# EAGLE design Brain1port (EAGLE 9.3.2)
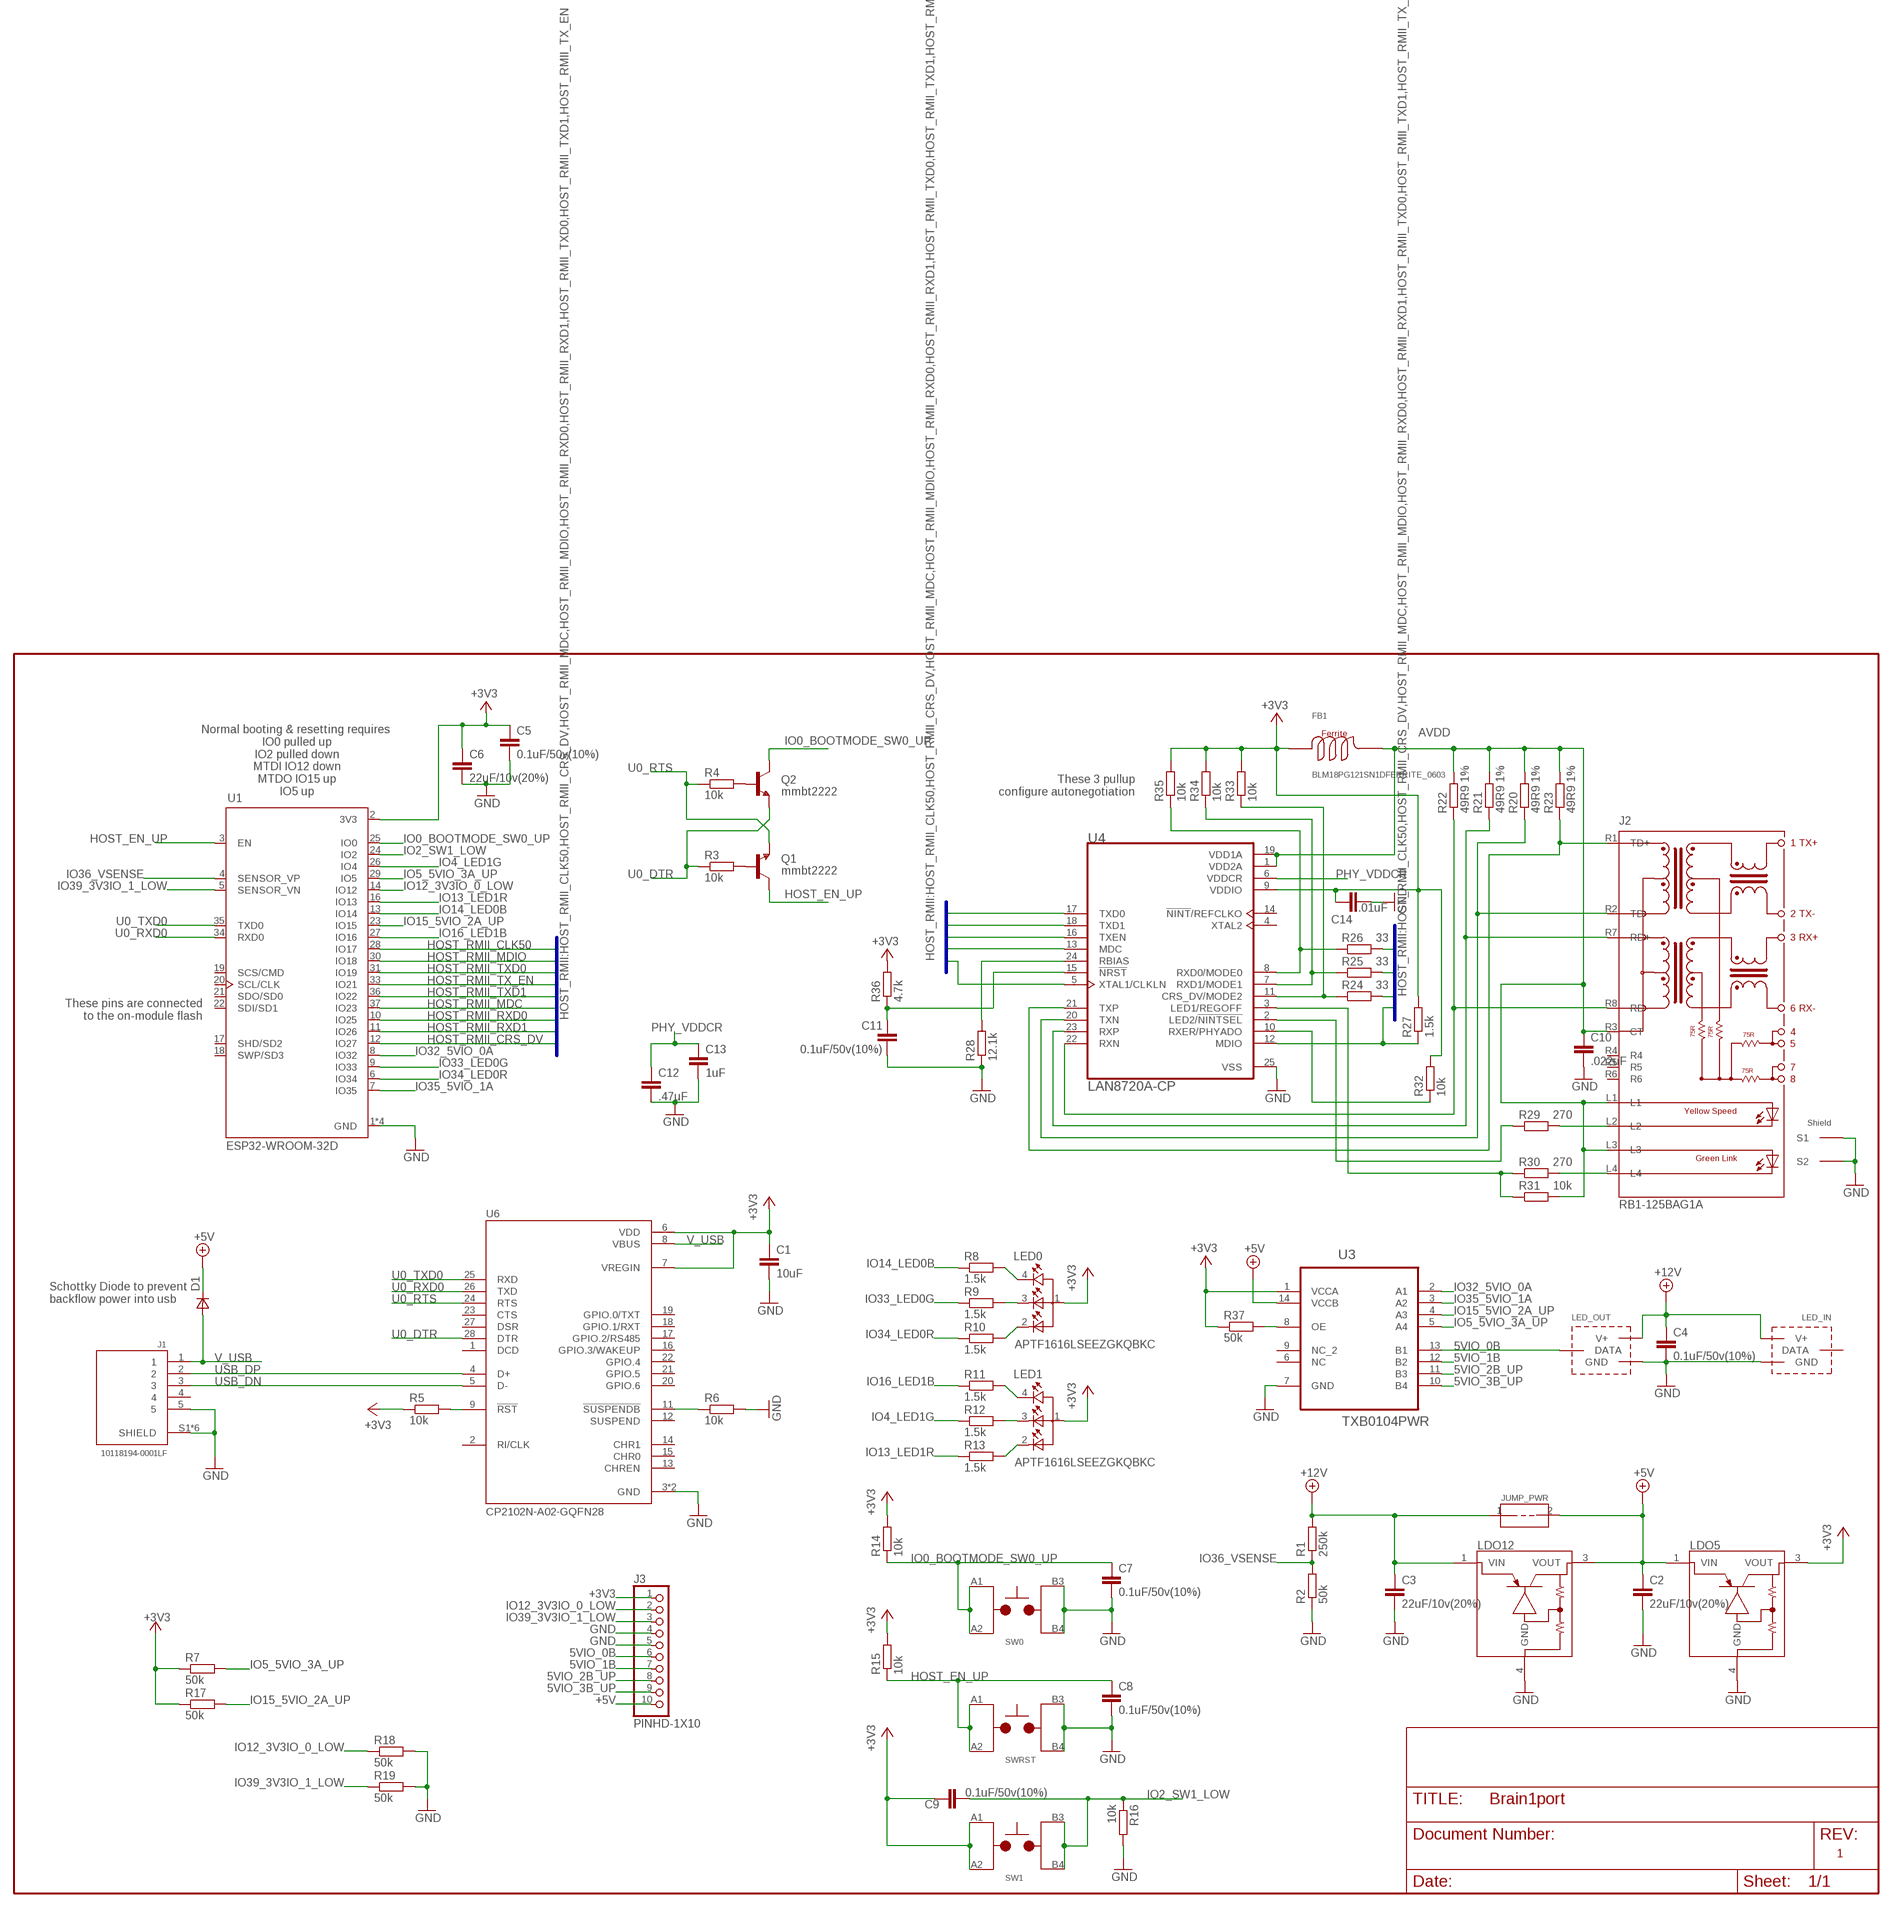
[diagram p0: schematic, sheet 1]

## Parts
C1  10uF  C-EUC0402  [C0402]
C2  22uF/10v(20%)  C-EUC0402  [C0402]
C3  22uF/10v(20%)  C-EUC0402  [C0402]
C4  0.1uF/50v(10%)  C-EUC0402  [C0402]
C5  0.1uF/50v(10%)  C-EUC0402  [C0402]
C6  22uF/10v(20%)  C-EUC0402  [C0402]
C7  0.1uF/50v(10%)  C-EUC0402  [C0402]
C8  0.1uF/50v(10%)  C-EUC0402  [C0402]
C9  0.1uF/50v(10%)  C-EUC0402  [C0402]
C10  .022uF  C-EUC0402  [C0402]
C11  0.1uF/50v(10%)  C-EUC0402  [C0402]
C12  .47uF  C-EUC0402  [C0402]
C13  1uF  C-EUC0402  [C0402]
C14  .01uF  C-EUC0402  [C0402]
D1  DSOD323  [SOD323]
FB1  BLM18PG121SN1DFERRITE_0603  [L0603]
J1  10118194-0001LF  [AMPHENOL_10118194-0001LF]
J2  RB1-125BAG1A  [WIZNET_RB1-125BAG1A]
J3  PINHD-1X10  [1X10-BIG]
JUMP_PWR  PWR_SUPPLY_SHORT050_DRILLED  [SHORT_050_DRILLED]
LDO5  NCP5501DPAK3  [TO229P990X238-3]
LDO12  NCP5501DPAK3  [TO229P990X238-3]
LED0  APTF1616LSEEZGKQBKC  [LEDSC160X160X070-4N]
LED1  APTF1616LSEEZGKQBKC  [LEDSC160X160X070-4N]
LED_IN  3WAY_LED_CONWIRES  [3WAY_LED_WIRES]
LED_OUT  3WAY_LED_CONWIRES  [3WAY_LED_WIRES]
Q1  mmbt2222  MMBT2222ALT1-NPN-SOT23-BEC  [SOT23-BEC]
Q2  mmbt2222  MMBT2222ALT1-NPN-SOT23-BEC  [SOT23-BEC]
R1  250k  R-EU_R0402  [R0402]
R2  50k  R-EU_R0402  [R0402]
R3  10k  R-EU_R0402  [R0402]
R4  10k  R-EU_R0402  [R0402]
R5  10k  R-EU_R0402  [R0402]
R6  10k  R-EU_R0402  [R0402]
R7  50k  R-EU_R0402  [R0402]
R8  1.5k  R-EU_R0402  [R0402]
R9  1.5k  R-EU_R0402  [R0402]
R10  1.5k  R-EU_R0402  [R0402]
R11  1.5k  R-EU_R0402  [R0402]
R12  1.5k  R-EU_R0402  [R0402]
R13  1.5k  R-EU_R0402  [R0402]
R14  10k  R-EU_R0402  [R0402]
R15  10k  R-EU_R0402  [R0402]
R16  10k  R-EU_R0402  [R0402]
R17  50k  R-EU_R0402  [R0402]
R18  50k  R-EU_R0402  [R0402]
R19  50k  R-EU_R0402  [R0402]
R20  49R9 1%  R-EU_R0402  [R0402]
R21  49R9 1%  R-EU_R0402  [R0402]
R22  49R9 1%  R-EU_R0402  [R0402]
R23  49R9 1%  R-EU_R0402  [R0402]
R24  33  R-EU_R0402  [R0402]
R25  33  R-EU_R0402  [R0402]
R26  33  R-EU_R0402  [R0402]
R27  1.5k  R-EU_R0402  [R0402]
R28  12.1k  R-EU_R0402  [R0402]
R29  270  R-EU_R0402  [R0402]
R30  270  R-EU_R0402  [R0402]
R31  10k  R-EU_R0402  [R0402]
R32  10k  R-EU_R0402  [R0402]
R33  10k  R-EU_R0402  [R0402]
R34  10k  R-EU_R0402  [R0402]
R35  10k  R-EU_R0402  [R0402]
R36  4.7k  R-EU_R0402  [R0402]
R37  50k  R-EU_R0402  [R0402]
SW0  TL3301T3301SWITCH  [SW-4]
SW1  TL3301T3301SWITCH  [SW-4]
SWRST  TL3301T3301SWITCH  [SW-4]
U1  ESP32-WROOM-32D  [MODULE_ESP32-WROOM-32D]
U3  TXB0104PWR  [SOP65P640X120-14N]
U4  LAN8720A-CP  [QFN50P400X400X100-25N]
U6  CP2102N-A02-GQFN28  CP2102N-A01-GQFN28  [QFN50P500X500X80-29N]
U$3  PWR_SUPPLY_SHORT050_DRILLED  [SHORT_050_DRILLED]  (not placed on a sheet)

## Nets
5VIO_0B: J3.6 LED_OUT.DATA U3.13(B1)
5VIO_1B: J3.7 U3.12(B2)
5VIO_2B_UP: J3.8 U3.11(B3)
5VIO_3B_UP: J3.9 U3.10(B4)
+3V3 [power]: C1.1 C5.1 C6.1 C9.1 C14.1 FB1.1 J3.1 LDO5.3(VOUT) LED0.1 LED1.1 R5.1 R7.1 R14.2 R15.2 R17.1 R27.2 R32.2 R33.2 R34.2 R35.2 R36.2 R37.1 SW1.A1 SW1.A2 U1.2(3V3) U3.1(VCCA) U4.9(VDDIO) U6.6(VDD) U6.7(VREGIN)
+5V [power]: C2.1 D1.1(C) J3.10 JUMP_PWR.2 LDO5.1(VIN) LDO12.3(VOUT) U3.14(VCCB)
+12V: C3.1 C4.1 JUMP_PWR.1 LDO12.1(VIN) LED_IN.V+ LED_OUT.V+ R1.2
AVDD: C10.1 FB1.2 J2.L1 J2.L3 J2.R3(CT) R20.2 R21.2 R22.2 R23.2 R31.2 U4.1(VDD2A) U4.19(VDD1A)
GND [power]: C1.2 C2.2 C3.2 C4.2 C5.2 C6.2 C7.2 C8.2 C10.2 C11.2 C12.2 C13.2 C14.2 J1.5 J1.S1(SHIELD) J1.S2(SHIELD) J1.S3(SHIELD) J1.S4(SHIELD) J1.S5(SHIELD) J1.S6(SHIELD) J2.S1 J2.S2 J3.4 J3.5 LDO5.4(GND) LDO12.4(GND) LED_IN.GND LED_OUT.GND R2.1 R6.2 R16.2 R18.2 R19.2 R28.1 SW0.B3 SW0.B4 SWRST.B3 SWRST.B4 U1.1(GND) U1.15(GND) U1.38(GND) U1.39(GND) U3.7(GND) U4.25(VSS) U6.3(GND) U6.29(GND)
HOST_EN_UP: C8.1 Q1.C R15.1 SWRST.A1 SWRST.A2 U1.3(EN)
HOST_RMII_CLK50: U1.28(IO17) U4.5(XTAL1/CLKLN)
HOST_RMII_CRS_DV: R24.2 U1.12(IO27)
HOST_RMII_MDC: U1.37(IO23) U4.13(MDC)
HOST_RMII_MDIO: R27.1 U1.30(IO18) U4.12(MDIO)
HOST_RMII_RXD0: R26.2 U1.10(IO25)
HOST_RMII_RXD1: R25.2 U1.11(IO26)
HOST_RMII_TX_EN: U1.33(IO21) U4.16(TXEN)
HOST_RMII_TXD0: U1.31(IO19) U4.17(TXD0)
HOST_RMII_TXD1: U1.36(IO22) U4.18(TXD1)
IO0_BOOTMODE_SW0_UP: C7.1 Q2.C R14.1 SW0.A1 SW0.A2 U1.25(IO0)
IO2_SW1_LOW: C9.2 R16.1 SW1.B3 SW1.B4 U1.24(IO2)
IO4_LED1G: R12.1 U1.26(IO4)
IO5_5VIO_3A_UP: R7.2 U1.29(IO5) U3.5(A4)
IO12_3V3IO_0_LOW: J3.2 R18.1 U1.14(IO12)
IO13_LED1R: R13.1 U1.16(IO13)
IO14_LED0B: R8.1 U1.13(IO14)
IO15_5VIO_2A_UP: R17.2 U1.23(IO15) U3.4(A3)
IO16_LED1B: R11.1 U1.27(IO16)
IO32_5VIO_0A: U1.8(IO32) U3.2(A1)
IO33_LED0G: R9.1 U1.9(IO33)
IO34_LED0R: R10.1 U1.6(IO34)
IO35_5VIO_1A: U1.7(IO35) U3.3(A2)
IO36_VSENSE: R1.1 R2.2 U1.4(SENSOR_VP)
IO39_3V3IO_1_LOW: J3.3 R19.1 U1.5(SENSOR_VN)
N$5: R5.2 U6.9(!RST)
N$6: R6.1 U6.11(!SUSPENDB)
N$7: Q1.B R3.2
N$8: Q2.B R4.2
N$9: LED0.4 R8.2
N$10: LED0.3 R9.2
N$11: LED0.2 R10.2
N$12: J2.R8(RD-) R22.1 U4.22(RXN)
N$13: J2.R7(RD+) R21.1 U4.23(RXP)
N$14: LED1.4 R11.2
N$15: LED1.3 R12.2
N$16: LED1.2 R13.2
N$17: J2.R2(TD-) R20.1 U4.20(TXN)
N$18: R24.1 R33.1 U4.11(CRS_DV/MODE2)
N$19: J2.R1(TD+) R23.1 U4.21(TXP)
N$20: R25.1 R34.1 U4.7(RXD1/MODE1)
N$21: R26.1 R35.1 U4.8(RXD0/MODE0)
N$22: R28.2 U4.24(RBIAS)
N$23: R30.1 R31.1 U4.3(LED1/REGOFF)
N$24: R29.1 U4.2(LED2/!NINTSEL!)
N$25: J2.L2 R29.2
N$26: J2.L4 R30.2
N$27: R37.2 U3.8(OE)
N$28: C11.1 R36.1 U4.15(!NRST)
N$29: R32.1 U4.10(RXER/PHYADO)
PHY_VDDCR: C12.1 C13.1 U4.6(VDDCR)
U0_DTR: Q2.E R3.1 U6.28(DTR)
U0_RTS: Q1.E R4.1 U6.24(RTS)
U0_RXD0: U1.34(RXD0) U6.26(TXD)
U0_TXD0: U1.35(TXD0) U6.25(RXD)
USB_DN: J1.3 U6.5(D-)
USB_DP: J1.2 U6.4(D+)
V_USB [power]: D1.2(A) J1.1 U6.8(VBUS)
Unconnected: J1.4 J2.R4 J2.R5 J2.R6 LED_IN.DATA U1.17(SHD/SD2) U1.18(SWP/SD3) U1.19(SCS/CMD) U1.20(SCL/CLK) U1.21(SDO/SD0) U1.22(SDI/SD1) U3.6(NC) U3.9(NC_2) U4.4(XTAL2) U4.14(!NINT!/REFCLKO) U6.1(DCD) U6.2(RI/CLK) U6.12(SUSPEND) U6.13(CHREN) U6.14(CHR1) U6.15(CHR0) U6.16(GPIO.3/WAKEUP) U6.17(GPIO.2/RS485) U6.18(GPIO.1/RXT) U6.19(GPIO.0/TXT) U6.20(GPIO.6) U6.21(GPIO.5) U6.22(GPIO.4) U6.23(CTS) U6.27(DSR) U$3.1 U$3.2

## Buses
HOST_RMII:HOST_RMII_CLK50,HOST_RMII_CRS_DV,HOST_RMII_MDC,HOST_RMII_MDIO,HOST_RMII_RXD0,HOST_RMII_RXD1,HOST_RMII_TXD0,HOST_RMII_TXD1,HOST_RMII_TX_EN

## Notes on the sheet
- Normal booting & resetting requires 
  IO0 pulled up
  IO2 pulled down
  MTDI IO12 down
  MTDO IO15 up
  IO5 up
- These 3 pullup
  configure autonegotiation
- These pins are connected
  to the on-module flash
- Schottky Diode to prevent
  backflow power into usb
- 1

## Library data of the parts
C1-C14 = rcl:C-EU: CAPACITOR, European symbol
D1 = zetex:D: DIODE; MPN: CDSOD323-T05C; OC_FARNELL: 1824860; OC_NEWARK: 79R6078
FB1 = TomSeago:BLM18PG121SN1D
J1 = 10118194-0001LF:10118194-0001LF: Micro Usb, 2.0 Type b, Rcpt, Smt; DESCRIPTION: Micro Usb, 2.0 Type b, Rcpt, Smt; DIGI-KEY_PART_NUMBER: 609-4618-1-ND; DIGI-KEY_PURCHASE_URL: https://www.digikey.com/product-detail/en/amphenol-icc-fci/10118194-0001LF/609-4618-1-ND/2785382?utm_source=snapeda&utm_medium=aggregator&utm_campaign=symbol; MF: Amphenol ICC; MP: 10118194-0001LF; PACKAGE: None
J2 = TomSeago:RB1-125BAG1A: Wiznet RB1-125BAG1A RJ45 1x1 Tab Down Through Hole
J3 = adafruit:PINHD-1X10: Pin header 1x10 0.1" spacing With round pins
JUMP_PWR U$3 = TomSeago:PWR_SUPPLY_SHORT
LDO5 LDO12 = TomSeago:NCP5501
LED0 LED1 = APTF1616LSEEZGKQBKC:APTF1616LSEEZGKQBKC: HELI Colour; 1.6X1.6MM LOW CURRENT RGB SMD LED; AVAILABILITY: Unavailable; DESCRIPTION: HELI Colour; 1.6X1.6MM LOW CURRENT RGB SMD LED; MF: Kingbright; MP: APTF1616LSEEZGKQBKC; PACKAGE: 0606 Kingbright; PRICE: None
LED_IN LED_OUT = TomSeago:3WAY_LED_CON
Q1 Q2 = transistor:*-NPN-: NPN Transistror BF959 corrected 2008.03.06
R1-R37 = rcl:R-EU_: RESISTOR, European symbol
SW0 SW1 SWRST = TomSeago:TL3301
U1 = ESP32-WROOM-32D:ESP32-WROOM-32D: IC: SoC; GPIO, I2C, I2S, IR, SD, SDIO, SPI, UART; 2.7÷3.6VDC; 20dBm; DESCRIPTION: IC: SoC; GPIO, I2C, I2S, IR, SD, SDIO, SPI, UART; 2.7÷3.6VDC; 20dBm; DIGI-KEY_PART_NUMBER: 1904-1023-1-ND; DIGI-KEY_PURCHASE_URL: https://www.digikey.com/product-detail/en/espressif-systems/ESP32-WROOM-32D/1904-1023-1-ND/9381732?utm_source=snapeda&utm_medium=aggregator&utm_campaign=symbol; MF: Espressif Systems; MP: ESP32-WROOM-32D; PACKAGE: Module Espressif Systems
U3 = TXB0104PWR:TXB0104PWR: 4-BIT BIDIRECTIONAL VOLTAGE-LEVEL TRANSLATOR; AVAILABILITY: Unavailable; DESCRIPTION: 4-Bit Bidirectional Voltage-Level Shifter with Auto Direction Sensing and +/-15 kV ESD Protect 14-TSSOP -40 to 85; MF: Texas Instruments; MP: TXB0104PWR; PACKAGE: TSSOP-14 Texas Instruments; PRICE: None
U4 = LAN8720A-CP:LAN8720A-CP: LAN8720A Series 3.3 V RMII 10/100 Ethernet Transceiver Surface Mount - QFN-24; DESCRIPTION: LAN8720A Series 3.3 V RMII 10/100 Ethernet Transceiver Surface Mount - QFN-24; DIGI-KEY_PART_NUMBER: 638-1080-ND; DIGI-KEY_PURCHASE_URL: https://www.digikey.com/product-detail/en/microchip-technology/LAN8720A-CP/638-1080-ND/2051556?utm_source=snapeda&utm_medium=aggregator&utm_campaign=symbol; MF: Microchip; MP: LAN8720A-CP; PACKAGE: QFN-24 Microchip
U6 = CP2102N-A01-GQFN28:CP2102N-A01-GQFN28: Ic Bridge Usb To Uart 28qfn; AVAILABILITY: Unavailable; DESCRIPTION: Usb-Uart Interface Bridge, Qfn-28; MF: Silicon Labs; MP: CP2102N-A01-GQFN28; PACKAGE: QFN-28 Silicon Labs; PRICE: None

## Net classes
1 power: width 0.61 mm, clearance 0.203 mm

## Board
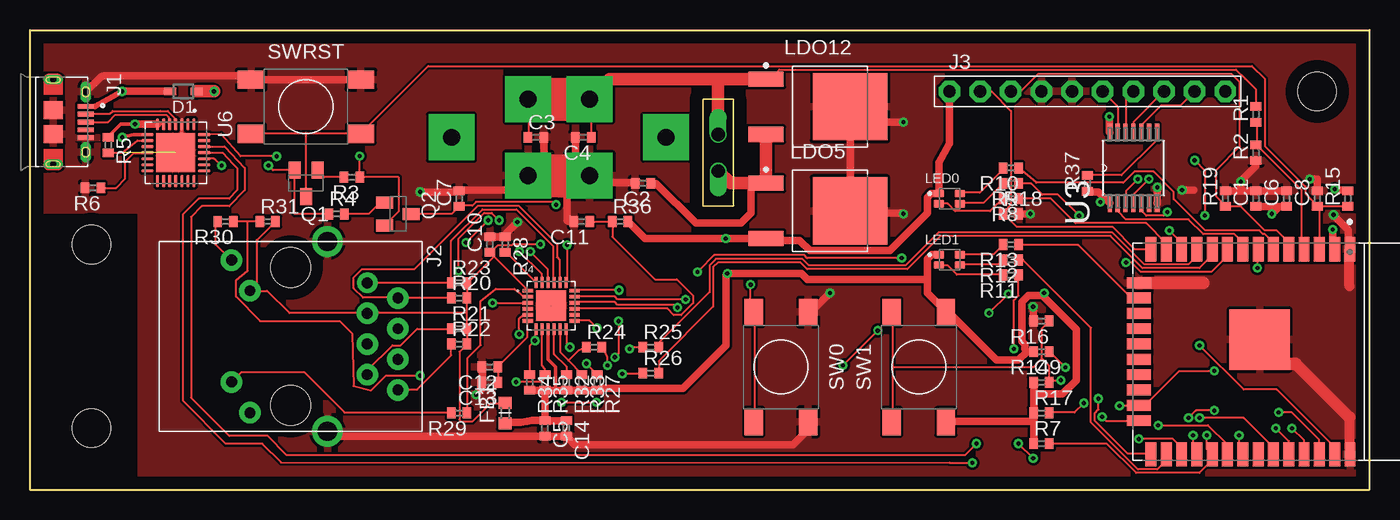
[diagram p1: board, top side]
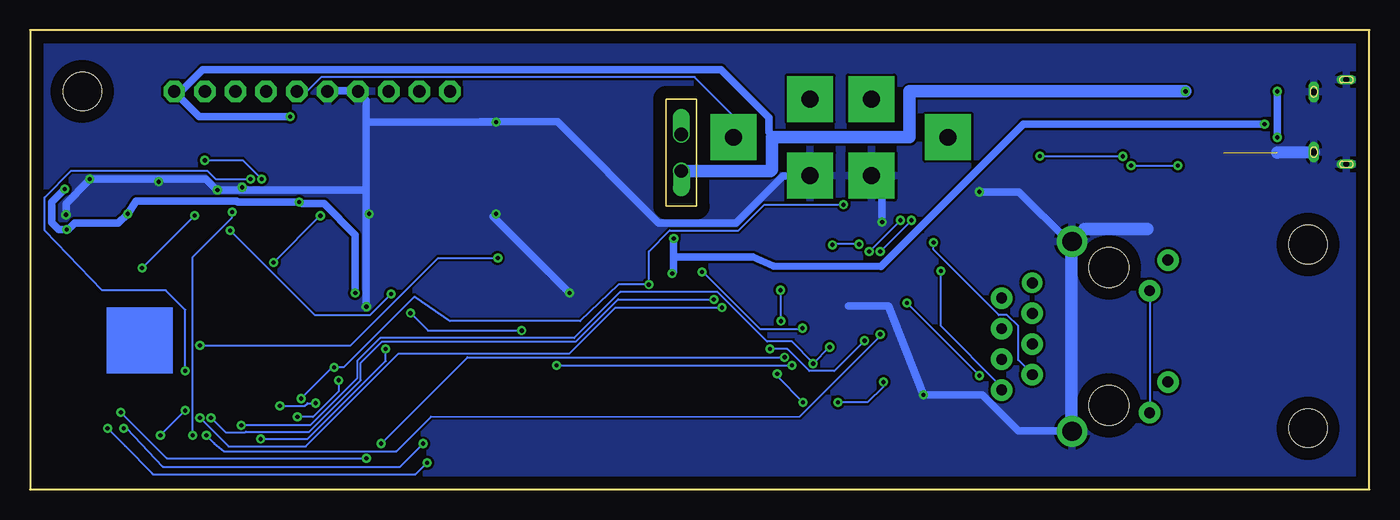
[diagram p2: board, bottom side, seen from below]

Size 111 x 38.1 mm. Coordinates in mm from the lower left corner, seen from the top.
Outline: 0,0 0,38.1 111,38.1 111,0 0,0
Copper layers (1*16): Top 0.035mm / dielectric 1.5mm / Bottom 0.035mm
Design rules "default *": minimum track width 6mil, minimum drill 0.35mm, track to track 6mil, track to pad 6mil, pad to pad 6mil, via to via 6mil, smd to smd 6mil, copper to edge 40mil, drill to drill 18mil, minimum pad ring 6mil, minimum via ring 8mil, stop-mask expansion 4mil, vias tented up to drill 0mil, thermal gap 10mil
Holes 3.17 mm at 5.08,5.08 5.08,20.32 106.68,33.02
tRestrict: area 0,0 to 8.9,22.9

### Footprints (pad centres in the part's own frame; a part is rotated, then mirrored left to right if it is on the bottom)
C0402 = smd 0.7 x 0.9: 1 -0.65,0; 2 0.65,0
SOD323 = smd 1 x 0.6: 1 -1.1,0; 2 1.1,0
L0603 = smd 1 x 1.1: 1 -0.85,0; 2 0.85,0
AMPHENOL_10118194-0001LF = smd 0.4 x 1.35: 1 -1.3,2.7; 2 -0.65,2.7; 3 0,2.7; 4 0.65,2.7; 5 1.3,2.7 | drill 0.55 pad 0.65 long: S1 -2.5,2.7; S2 2.5,2.7 | drill 0.5 pad 0.775 long: S3 -3.5,0; S6 3.5,0 | smd 1.5 x 1.55: S4 -1,0; S5 1,0
WIZNET_RB1-125BAG1A = drill 0.9 pad 1.778: L1 6.325,-3.38; L2 3.784,-4.899; L3 -3.786,-3.379; L4 -6.325,-4.9; R2 -3.176,8.889; R3 -1.906,6.349; R4 -0.636,8.889; R5 0.634,6.349; R6 1.904,8.889; R7 3.174,6.349; R8 4.444,8.889 | drill 0.9 pad 1.7: R1 -4.446,6.349 | drill 1.6 pad 2.54: S1 -7.876,3.049; S2 7.874,3.049 | hole 3.3: 5.714,-0.001; -5.716,-0.001
1X10-BIG = drill 1.016 pad 1.778 octagon: 1 -11.43,0; 2 -8.89,0; 3 -6.35,0; 4 -3.81,0; 5 -1.27,0; 6 1.27,0; 7 3.81,0; 8 6.35,0; 9 8.89,0; 10 11.43,0
SHORT_050_DRILLED = drill 1.1 offset: 1 -0.889,0; 2 2.159,0
TO229P990X238-3 = smd 2.934 x 1.256: 1 -4.291,2.29; 3 -4.291,-2.29 | smd 6.154 x 5.567: 4 2.681,0
LEDSC160X160X070-4N = smd 0.89 x 0.64: 1 -0.87,0.425; 2 0.87,0.425; 3 0.87,-0.425; 4 -0.87,-0.425
3WAY_LED_WIRES = drill 1.4 pad 3.81 square: DATA -3.175,0; GND 3.175,-3.175; V+ 3.175,3.175
SOT23-BEC = smd 1 x 1.4: B -0.95,-1.1; C 0,1.1; E 0.95,-1.1
R0402 = smd 0.7 x 0.9: 1 -0.65,0; 2 0.65,0
SW-4 = smd 2.212 x 1.512: A1 -4.55,-2.25; A2 4.55,-2.25; B3 -4.55,2.25; B4 4.55,2.25
MODULE_ESP32-WROOM-32D = smd 2 x 0.9: 1 -8.5,5.26; 2 -8.5,3.99; 3 -8.5,2.72; 4 -8.5,1.45; 5 -8.5,0.18; 6 -8.5,-1.09; 7 -8.5,-2.36; 8 -8.5,-3.63; 9 -8.5,-4.9; 10 -8.5,-6.17; 11 -8.5,-7.44; 12 -8.5,-8.71; 13 -8.5,-9.98; 14 -8.5,-11.25; 25 8.5,-11.25; 26 8.5,-9.98; 27 8.5,-8.71; 28 8.5,-7.44; 29 8.5,-6.17; 30 8.5,-4.9; 31 8.5,-3.63; 32 8.5,-2.36; 33 8.5,-1.09; 34 8.5,0.18; 35 8.5,1.45; 36 8.5,2.72; 37 8.5,3.99; 38 8.5,5.26 | smd 0.9 x 2: 15 -5.715,-12.25; 16 -4.445,-12.25; 17 -3.175,-12.25; 18 -1.905,-12.25; 19 -0.635,-12.25; 20 0.635,-12.25; 21 1.905,-12.25; 22 3.175,-12.25; 23 4.445,-12.25; 24 5.715,-12.25 | smd 5 x 5: 39 -1,-2.24
SOP65P640X120-14N = smd 1.473 x 0.356: 1 -2.921,1.956; 2 -2.921,1.295; 3 -2.921,0.66; 4 -2.921,0; 5 -2.921,-0.66; 6 -2.921,-1.295; 7 -2.921,-1.956; 8 2.921,-1.956; 9 2.921,-1.295; 10 2.921,-0.66; 11 2.921,0; 12 2.921,0.66; 13 2.921,1.295; 14 2.921,1.956
QFN50P400X400X100-25N = smd 0.86 x 0.26: 1 -1.935,1.25; 2 -1.935,0.75; 3 -1.935,0.25; 4 -1.935,-0.25; 5 -1.935,-0.75; 6 -1.935,-1.25; 13 1.935,-1.25; 14 1.935,-0.75; 15 1.935,-0.25; 16 1.935,0.25; 17 1.935,0.75; 18 1.935,1.25 | smd 0.26 x 0.86: 7 -1.25,-1.935; 8 -0.75,-1.935; 9 -0.25,-1.935; 10 0.25,-1.935; 11 0.75,-1.935; 12 1.25,-1.935; 19 1.25,1.935; 20 0.75,1.935; 21 0.25,1.935; 22 -0.25,1.935; 23 -0.75,1.935; 24 -1.25,1.935 | smd 2.5 x 2.5: 25 0,0
QFN50P500X500X80-29N = smd 1.01 x 0.27: 1 -2.36,1.5; 2 -2.36,1; 3 -2.36,0.5; 4 -2.36,0; 5 -2.36,-0.5; 6 -2.36,-1; 7 -2.36,-1.5; 15 2.36,-1.5; 16 2.36,-1; 17 2.36,-0.5; 18 2.36,0; 19 2.36,0.5; 20 2.36,1; 21 2.36,1.5 | smd 0.27 x 1.01: 8 -1.5,-2.36; 9 -1,-2.36; 10 -0.5,-2.36; 11 0,-2.36; 12 0.5,-2.36; 13 1,-2.36; 14 1.5,-2.36; 22 1.5,2.36; 23 1,2.36; 24 0.5,2.36; 25 0,2.36; 26 -0.5,2.36; 27 -1,2.36; 28 -1.5,2.36 | smd 3.25 x 3.25: 29 0,0

### Placement (x,y rotation side)
C1  101.6,24.13 90 top
C2  50.8,25.4 180 top
C3  41.91,29.21 0 top
C4  45.85,29.21 180 top
C5  42.67,5.08 270 top
C6  104.14,24.13 90 top
C7  35.56,24.13 90 top
C8  106.68,24.13 90 top
C9  83.82,8.89 0 top
C10  38.1,20.32 90 top
C11  45.72,22.23 180 top
C12  38.1,10.16 180 top
C13  38.1,8.89 180 top
C14  44.45,5.08 270 top
D1  12.7,33.02 180 top
FB1  39.37,6.35 90 top
J1  1.91,30.48 270 top
J2  21.59,12.7 270 top
J3  87.63,33.02 0 top
JUMP_PWR  57.02,28.57 270 top
LDO5  65.28,23.11 0 top
LDO12  65.28,31.75 0 top
LED0  76.2,24.13 0 top
LED1  76.2,19.05 0 top
LED_IN  38.1,29.21 0 top
LED_OUT  49.53,29.21 0 bottom
Q1  22.86,25.4 180 top
Q2  30.48,22.86 270 top
R1  101.6,31.11 90 top
R2  101.6,27.94 90 top
R3  26.67,25.91 180 top
R4  25.4,22.86 0 top
R5  6.48,28.57 270 top
R6  5.21,25.02 180 top
R7  83.82,3.81 0 top
R8  81.28,24.13 180 top
R9  81.28,25.4 180 top
R10  81.28,26.67 180 top
R11  81.28,17.78 180 top
R12  81.28,19.05 180 top
R13  81.28,20.32 180 top
R14  83.82,11.43 180 top
R15  109.22,24.13 90 top
R16  83.82,13.97 180 top
R17  83.82,6.35 0 top
R18  81.28,22.86 0 top
R19  99.06,24.13 90 top
R20  35.56,15.88 0 top
R21  35.56,13.34 0 top
R22  35.56,12.06 0 top
R23  35.56,17.14 0 top
R24  46.74,11.81 0 top
R25  51.44,11.81 0 top
R26  51.44,9.65 0 top
R27  46.99,8.89 270 top
R28  39.37,20.32 270 top
R29  35.56,6.35 180 top
R30  16.19,22.23 180 top
R31  19.68,22.23 0 top
R32  44.45,8.89 270 top
R33  45.72,8.89 270 top
R34  41.4,8.89 270 top
R35  42.67,8.89 270 top
R36  48.9,22.23 0 top
R37  87.63,25.4 90 top
SW0  62.23,10.16 270 top
SW1  73.66,10.16 90 top
SWRST  22.86,31.75 0 top
U1  104.14,11.43 270 top
U3  91.44,26.67 90 top
U4  43.18,15.24 0 top
U6  12.06,27.94 270 top

### Tracks (layer width: path | path; a pad name or v marks a point on that pad's centre or on a via)
5VIO_0B
  Top 0.152: U3.13 90.14,31.77 J3.6
  Bottom 0.152: J3.6 88.85,33.07 88.01,33.07 86.87,34.21 55.93,34.21 52.73,31.01 52.73,29.26 LED_OUT.DATA
5VIO_1B
  Top 0.152: U3.12 90.83,29.64 90.83,32.38 91.44,32.99 J3.7
5VIO_2B_UP
  Top 0.152: U3.11 91.44,30.48 J3.8
5VIO_3B_UP
  Top 0.152: U3.10 92.13,29.64 92.13,30.25 93.73,31.85 95.33,31.85 96.47,32.99 J3.9
+3V3  (via drill 0.35)
  Top 0.152: 7.5,30.29 7.5,30.31 | v8.69,30.3 8.67,30.29
  Top 0.254: U6.6 U6.7
  Top 0.305: 7.5,30.31 6.48,29.29 R5.1 | 8.67,30.29 7.5,30.29 | U4.9 42.93,10.79 43.56,10.16 43.56,8.23
  Top 0.61: U3.1 89.04,24.19 | 89.04,24.19 88.54,24.69 87.63,24.69 R37.1 | C1.1 101.65,23.47 104.09,23.47 C6.1 103.54,23.48 v102.92,22.86 | v108.13,24.92 108.2,24.84 109.19,24.84 R15.2 | v107.97,21.57 107.97,20.09 U1.2 | v88.7,23.85 89.04,24.19 | 83.21,5.64 83.21,6.33 R17.1 83.21,6.63 83.21,7.92 | 83.21,5.64 83.21,3.81 R7.1 | 83.21,7.92 83.21,8.84 C9.1 | 83.21,5.64 75.97,5.64 SW1.A1 | R34.2 42.62,8.23 R35.2 | R35.2 42.93,8.23 43.56,8.23 44.42,8.23 R32.2 44.73,8.23 R33.2 45.95,8.23 46.94,8.23 R27.2 47.24,8.38 54.13,8.38 57.68,11.94 57.68,17.8 v57.78,17.91 63.93,17.91 64.41,17.42 74.37,17.42 | C5.1 42.7,5.71 44.42,5.71 C14.1 | FB1.1 39.4,5.56 40.64,5.56 41.2,5.66 41.61,5.73 C5.1 | R35.2 C5.1 | 74.37,17.42 74.37,16.31 75.89,14.78 SW1.A2 76.2,14.63 80.09,10.74 81.92,10.74 82.6,11.43 | 74.37,17.42 74.37,19.13 74.75,19.51 75.29,19.51 LED1.1 | 82.6,11.43 R14.2 | 83.21,7.92 85.57,7.92 86.72,9.07 86.72,13.26 83.9,16.08 | 83.9,16.08 82.75,16.08 82.22,15.54 82.22,12.27 82.45,12.04 82.45,11.66 82.6,11.43 | v84.05,16.31 83.9,16.08 | R36.2 50.94,20.83 v57.66,20.83 57.91,20.83 LDO5.3 | J3.1 76.2,28.67 75.33,27.09 LED0.1 75.06,24.54 74.68,24.54 74.37,24.23 74.37,22.94 71.25,19.81 64.62,19.81 63.78,20.65 61.49,20.65 LDO5.3 | U6.7 v8.69,30.3 | LDO5.3
  Bottom 0.61: v108.13,24.92 109.19,23.85 109.19,22.15 108.61,21.57 v107.97,21.57 107.82,21.57 107.29,22.1 103.68,22.1 v102.92,22.86 102.21,23.93 93.88,23.93 93.8,23.85 v88.7,23.85 88.47,23.7 86.64,23.7 84.05,21.11 v84.05,16.31 | v8.69,30.3 28.68,30.3 40.46,18.52 49.4,18.54 51.08,19.3 57.66,19.3 v57.66,20.83 57.66,18.03 v57.78,17.91
+5V  (via drill 0.35)
  Top 0.61: C2.1 51.51,25.38 51.89,25.38 55.17,22.1 58.9,22.1 59.74,22.94 59.74,24.92 LDO5.1 | v89.46,30.94 89.46,29.64 U3.14
  Top 1.016: LDO12.3 LDO5.1 58.03,25.4 JUMP_PWR.2 | v15.24,33.02 D1.1
  Bottom 0.61: v89.46,30.94 97,30.94 99.06,32.99 J3.10 98.6,32.92 96.7,34.82 53.72,34.82 49.76,30.86 49.76,29.64 49.53,29.21
  Bottom 1.016: JUMP_PWR.2 49.66,26.42 49.53,26.54 49.53,29.21 38.1,29.21 38.1,33.02 v15.24,33.02
+12V
  Top 0.152: C3.1 41.3,29.26 41.3,30.63 LED_IN.V+ | LED_OUT.V+ 46.35,31.23 46.57,31.17 46.5,31.1 C4.1 | LDO12.1 61.49,34.21 62.1,34.82 99.95,34.82 100.71,34.06 100.74,34.06 101.58,33.22 101.58,31.77 R1.2
  Top 1.016: LDO12.1 56.9,34.04 | 56.9,34.04 48.01,34.04 LED_OUT.V+ | JUMP_PWR.1 57.02,33.91 56.9,34.04
  Top 3.556: LED_IN.V+ LED_OUT.V+
AVDD  (via drill 0.35)
  Top 0.152: 38.44,19.32 C10.1 38.18,19.66 38.79,20.27 39.93,20.27 40.01,20.34 v42.29,20.34 | 38.44,19.32 41.22,16.54 U4.1 | v44.5,20.3 44.5,17.22 U4.19 | 36.2,13.34 36.2,12.12 R22.2 36.2,12.04 35.59,11.43 35.59,5.79 35.74,5.64 36.65,5.64 38.18,7.16 39.32,7.16 FB1.2 | 36.2,13.34 36.2,14.63 | 36.2,14.63 36.2,15.85 R20.2 36.2,15.93 36.2,17.14 R23.2 36.27,17.14 38.44,19.32 | 36.2,13.34 R21.2 | 36.2,14.63 27.96,14.63 J2.R3 27.89,14.63 21.49,14.63 19.63,16.49 J2.L3 18.8,17.07 18.8,20.7 R31.2
  Bottom 0.152: J2.L1 18.21,6.4 18.21,16.46 J2.L3 | v44.5,20.3 44.45,20.34 v42.29,20.34
GND  (via drill 0.35)  (2 unrouted)
  Top 0.305: U6.3 12.57,29.34 12.57,29.21
  Top 0.61: 101.88,12.5 U1.39 102.11,12.19 | 109.35,2.97 U1.38 | 109.35,19.89 U1.1 109.27,20.19 109.27,21.54 v108.03,22.78 | 100.36,24.77 101.58,24.77 C1.2 101.88,24.77 104.09,24.77 C6.2 | 100.36,24.77 99.06,24.77 R19.2 | C8.2 106.68,25.76 v106.07,25.76 | v83.13,15.16 83.13,14.02 R16.2 | v95.48,24.84 96.47,24.84 | v93.42,25.07 93.42,23.77 U3.7 | 100.36,24.77 v100.36,25.53 100.51,25.76 101.58,26.82 101.58,27.28 R2.1 | v72.39,30.48 71.12,30.48 LDO12.4 67.97,31.7 67.97,23.16 LDO5.4 68.2,22.94 72.31,22.94 v72.39,22.86 | J1.S5 2.13,29.34 | 4.57,32.92 J1.S1 5.88,34.26 6.13,34.34 17.97,34.34 SWRST.B3 18.36,33.98 27.36,33.98 SWRST.B4 | C10.2 38.1,20.95 39.32,20.95 R28.1 39.47,21.26 v40.39,22.17 | C11.2 44.66,22.23 44.5,22.3 44.5,24.31 LED_OUT.GND | C3.2 42.6,29.18 42.6,27.74 LED_IN.GND 39.78,25.07 39.55,24.84 35.59,24.84 C7.2 35.28,24.69 v32.31,24.69 | C4.2 45.2,27.56 45.22,27.58 46.35,26.45 LED_OUT.GND | C2.2 50.14,25.45 48.01,25.45 LED_OUT.GND | 24.61,20.65 J2.S1 | 64.52,14.67 SW0.B3 64.77,14.78 v66.29,16.31 | C12.2 37.49,10.13 37.49,8.91 C13.2 37.34,8.61 37.34,8.23 v36.96,7.85 | J2.S2 24.69,4.8 25.07,4.42 42.39,4.42 C5.2 42.7,4.42 44.42,4.42 C14.2 44.65,4.19 45.14,3.71 63.22,3.71 64.48,4.97 SW0.B4 | v82.91,22.86 R18.2 | U6.29 12.57,29.34
  Top 0.813: 109.35,5.97 109.35,2.97 | 109.35,16.87 109.35,19.89
  Top 1.016: 97.23,17.14 U1.15 | 109.35,5.97 104.9,10.41 103.89,10.41
  Top 3.556: LED_IN.GND LED_OUT.GND
  Bottom 0.61: 83.13,30.48 83.13,32.31 83.82,32.99 J3.4 84.05,33.07 86.33,33.07 J3.5 | 83.13,30.48 83.13,24.84 | 83.13,24.84 83.13,22.86 | 83.13,22.86 v83.13,15.16 | 83.13,24.84 93.42,24.84 | 93.42,24.84 v95.48,24.84 95.71,24.99 96.47,25.76 100.36,25.76 | v93.42,25.07 93.42,24.84 | 100.36,25.76 v106.07,25.76 106.22,25.53 108.03,23.72 v108.03,22.78 | v100.36,25.53 100.36,25.76 | 83.13,30.48 v72.39,30.48 72.39,30.5 | 1.91,33.91 J1.S3 | v4.57,32.99 J1.S1 | 1.91,27.05 J1.S6 | v4.57,27.96 J1.S2 | v40.39,22.17 40.39,25.15 LED_IN.GND | 24.69,20.57 J2.S1 24.99,20.65 29.03,24.69 v32.31,24.69 | 24.69,5.18 J2.S2 24.69,4.88 29.11,4.88 32.08,7.85 v36.96,7.85 39.87,15.24 U4.25 | 72.39,30.5 67.3,30.5 58.9,22.1 52.5,22.1 48.62,25.98 46.41,25.98 LED_OUT.GND | 72.39,30.5 73.68,30.5 | v66.29,16.31 72.62,22.63 v72.39,22.86 | v82.91,22.86 83.13,22.86
  Bottom 1.016: 24.69,5.18 24.69,20.57 | J2.S1 23.62,21.59 18.41,21.59 | J1.S2 7.62,27.94
  pour Top: 0,0 0,38.1 110.49,38.1 110.49,0
  pour Bottom: 0,0 0,38.1 110.49,38.1 110.49,0
HOST_EN_UP
  Top 0.152: 106.91,23.47 109.19,23.47 R15.1 | 106.91,23.47 C8.1 | 106.91,23.47 106.91,19.96 U1.3 | 106.91,23.47 C8.1 | 18.29,29.49 SWRST.A1 18.36,29.57 22.86,29.57 | 22.86,29.57 27.36,29.57 SWRST.A2 27.43,29.57 32.99,35.13 101.27,35.13 102.34,34.06 102.34,28.5 105.69,25.15 105.69,24.54 106.68,23.55 C8.1 | Q1.C 22.86,29.57
HOST_RMII_CLK50  (via drill 0.35)
  Top 0.152: v40.54,12.88 40.54,14.17 40.84,14.48 41.22,14.48 U4.5 | v96.39,4.5 96.39,3.28 96.7,2.97 U1.28
  Bottom 0.152: v40.54,12.88 40.54,12.72 47.2,6.06 77.79,6.03 80.64,3.17 94.93,3.17 95.73,3.84 v96.39,4.5
HOST_RMII_CRS_DV  (via drill 0.35)
  Top 0.152: v47.85,10.29 47.85,11.02 R24.2 | v70.26,13.18 v67.36,10.29 | v81.08,16.23 v79.48,14.63 | v94.41,21.49 95.4,20.5 95.4,19.96 U1.12
  Bottom 0.152: v67.36,10.29 v47.85,10.29 | v70.26,13.18 78.03,13.18 v79.48,14.63 | v81.08,16.23 82.83,14.48 87.4,14.48 v94.41,21.49
HOST_RMII_MDC  (via drill 0.35)
  Top 0.152: v46.99,13.39 46.35,14.02 45.19,14.02 U4.13 | v55.32,18.03 55.19,18.21 55.47,18.21 56.69,19.43 64.16,19.43 64.39,19.2 v72.24,19.2 | v96.93,11.96 100.58,8.31 103.33,8.31 108.13,3.5 108.13,2.97 U1.37
  Bottom 0.152: v72.24,19.2 77.19,19.2 84.43,11.96 v96.93,11.96 | v46.99,13.39 47.02,13.34 50.52,13.34 55.17,17.98 55.32,17.98 v55.32,18.03
HOST_RMII_MDIO  (via drill 0.35)
  Top 0.152: v44.73,11.81 44.5,12.04 44.5,13.26 U4.12 | v46.1,10.44 46.94,9.6 R27.1 | v93.5,5.33 97.61,5.33 99.21,3.73 99.21,2.97 U1.30
  Bottom 0.152: v44.73,11.81 v46.1,10.44 46.1,10.52 47.85,12.27 49.91,12.27 54.03,16.38 62.1,16.38 65.91,12.57 81.99,12.57 83.9,10.67 83.9,9.22 87.78,5.33 v93.5,5.33
HOST_RMII_RXD0
  Top 0.152: U1.10 97.92,19.89 97.92,19.36 96.93,18.36 92.2,18.36 89.53,21.03 75.44,21.03 72.69,18.29 64.39,18.29 63.86,18.82 57,18.82 56.62,18.44 56.62,15.16 52.12,10.67 52.12,9.68 R26.2
HOST_RMII_RXD1
  Top 0.152: U1.11 96.7,19.89 96.7,19.36 96.01,18.67 92.35,18.67 89.69,21.34 75.29,21.34 72.54,18.59 64.54,18.59 64.01,19.13 56.84,19.13 56.31,18.59 56.31,16.38 52.12,12.19 52.12,11.81 R25.2
HOST_RMII_TX_EN  (via drill 0.35)
  Top 0.152: v96.93,5.94 100.58,5.94 103.02,3.5 103.02,2.97 U1.33 | U4.16 45.19,15.54 48.46,15.54 48.69,15.32 53.42,15.32 v53.65,15.09
  Bottom 0.152: v53.65,15.09 62.48,15.09 66.29,11.28 80.47,11.28 88.16,3.58 94.56,3.58 v96.93,5.94
HOST_RMII_TXD0  (via drill 0.35)
  Top 0.152: v96.01,5.94 96.62,6.55 v98.15,6.55 | v100.2,4.5 100.2,3.28 100.51,2.97 U1.31 | U4.17 45.19,16 48.46,16 48.69,15.77 v54.33,15.77
  Bottom 0.152: v54.33,15.77 62.26,15.77 65.76,12.27 81.84,12.27 83.59,10.52 83.59,9.07 87.86,4.8 93.12,4.8 93.19,4.72 94.79,4.72 v96.01,5.94 | v100.2,4.5 v98.15,6.55
HOST_RMII_TXD1  (via drill 0.35)
  Top 0.152: v48.82,16.54 45.19,16.54 U4.18 | v48.77,13.97 48.77,11.28 v48.46,10.97 | v83.13,2.59 v81.92,3.81 | v103.48,6.4 104.57,6.4 106.83,4.14 106.83,2.97 U1.36
  Bottom 0.152: v48.82,16.54 48.82,14.02 v48.77,13.97 | v48.46,10.97 74.75,10.97 v81.92,3.81 | v83.13,2.59 99.67,2.59 v103.48,6.4
IO0_BOOTMODE_SW0_UP  (via drill 0.35)
  Top 0.152: v85.8,10.13 84.51,11.43 R14.1 | v88.54,7.54 88.54,6.63 88.24,6.33 88.24,5.71 90.98,2.97 92.89,2.97 U1.25 | Q2.C 34.94,22.86 C7.1 35.59,23.55 36.65,23.55 36.96,23.85 43.36,23.85 v43.59,23.62 | v59.72,16.99 59.72,14.84 SW0.A1 60.02,14.67 60.02,5.64 60.05,5.64 SW0.A2
  Bottom 0.152: v88.54,7.54 85.95,10.13 v85.8,10.13 85.01,10.13 79.15,16 76.2,13.97 65.41,13.97 62.23,17.02 60.45,17.02 v59.72,16.99 59.72,19.76 57.99,21.49 52.27,21.49 50.14,23.62 v43.59,23.62
IO2_SW1_LOW  (via drill 0.35)
  Top 0.152: 71.48,10.13 71.48,14.71 SW1.B4 | 71.48,10.13 71.48,5.64 SW1.B3 | 84.43,9.07 84.43,10.29 83.86,10.86 | 84.43,9.07 84.43,8.91 C9.2 84.43,9.07 | 83.86,10.86 83.82,10.9 83.82,13.34 84.43,13.95 R16.1 | U1.24 89.15,5.71 v88.85,6.02 | 84.43,9.07 v85.42,9.07 | 71.48,10.13 83.13,10.13 83.86,10.86
  Bottom 0.152: v88.85,6.02 87.55,6.02 85.42,8.15 v85.42,9.07
IO4_LED1G
  Top 0.152: R12.1 82.3,19.05 87.94,13.41 87.94,5.56 91.82,1.68 93.42,1.68 94.11,2.36 94.11,2.9 U1.26
IO5_5VIO_3A_UP  (via drill 0.35)
  Top 0.152: R7.2 89.23,3.81 91.67,1.37 96.93,1.37 97.92,2.36 97.92,2.9 U1.29 97.92,2.97 97.54,3.35 v97.54,4.5 | v94.26,23.01 93.95,22.71 92.51,22.71 92.13,23.09 92.13,23.7 U3.5
  Bottom 0.152: v94.26,23.01 94.26,22.55 97.54,19.28 v97.54,4.5
IO12_3V3IO_0_LOW
  Top 0.152: U1.14 92.89,19.96 91.52,19.96 89.69,21.79 81.76,21.79 80.7,22.86 R18.1 80.77,22.86 80.77,23.09 81.31,23.62 81.31,31.39 79.7,32.99 78.79,32.99 J3.2
IO13_LED1R
  Top 0.152: R13.1 81.99,20.27 86.87,20.27 91.21,15.93 91.82,15.93 U1.16
IO14_LED0B
  Top 0.152: R8.1 84.61,24.13 86.64,22.1 92.51,22.1 94.11,20.5 94.11,19.96 U1.13
IO15_5VIO_2A_UP  (via drill 0.35)
  Top 0.152: v87.33,7.16 86.56,6.4 84.51,6.4 R17.2 | v90.3,6.93 91.82,6.93 U1.23 91.9,7.01 92.43,7.01 95.25,9.83 v98.15,9.83 | U3.4 91.44,24.46 v92.73,25.76
  Bottom 0.152: v87.33,7.16 88.01,7.16 88.24,6.93 v90.3,6.93 | v92.73,25.76 95.63,25.76 96.32,26.44 107.59,26.44 109.8,24.23 109.8,21.49 105.03,16.51 99.75,16.51 98.15,14.91 v98.15,9.83
IO16_LED1B  (via drill 0.35)
  Top 0.152: v81.53,11.66 81.53,15.7 81.92,16.08 81.92,17.75 R11.1 | v91.9,4.19 94.72,4.19 95.4,3.5 95.4,2.97 U1.27
  Bottom 0.152: v81.53,11.66 81.53,10.67 88.01,4.19 v91.9,4.19
IO32_5VIO_0A
  Top 0.152: U3.2 90.14,23.09 90.83,22.4 96.01,22.4 97.23,21.18 99.82,21.18 100.51,20.5 100.51,19.96 U1.8
IO33_LED0G  (via drill 0.35)
  Top 0.152: v86.94,22.71 85.19,24.46 83.9,24.46 82.98,25.38 81.99,25.38 R9.1 | v90.83,18.82 91.29,18.82 92.05,18.06 97.92,18.06 99.21,19.36 99.21,19.89 U1.9
  Bottom 0.152: v90.83,18.82 v86.94,22.71
IO34_LED0R
  Top 0.152: R10.1 83.4,25.45 90.6,25.45 91.52,26.36 93.12,26.36 94.79,24.69 94.79,24.08 97.38,21.49 101.88,21.49 102.18,21.18 102.34,21.18 103.02,20.5 103.02,19.96 U1.6
IO35_5VIO_1A  (via drill 0.35)
  Top 0.152: v91.82,25.76 90.83,24.77 90.83,23.77 U3.3 | v96.52,27.3 97.36,26.47 v97.36,22.73 | v101.73,18.36 101.73,19.89 U1.7
  Bottom 0.152: v91.82,25.76 93.37,27.3 v96.52,27.3 | v101.73,18.36 v97.36,22.73
IO36_VSENSE
  Top 0.152: 105.39,20.12 105.54,19.96 U1.4 105.39,20.12 | R1.1 101.65,30.4 101.65,28.65 R2.2 101.65,28.57 105.39,24.84 105.39,20.12
IO39_3V3IO_1_LOW
  Top 0.152: U1.5 104.32,19.96 104.32,20.5 103.33,21.49 102.34,21.49 100.36,23.47 R19.1 99.06,23.55 98.3,24.31 98.3,26.49 100.28,28.47 100.28,33.78 99.62,34.44 83.52,34.44 82.14,33.07 81.31,33.07 J3.3 81.23,32.99
N$5
  Top 0.152: R5.2 7.62,27.94 8.89,28.96 U6.9
N$6
  Top 0.152: U6.11 9.68,27.89 8.59,27.89 7.87,27.18 7.87,25.78 7.11,25.02 R6.1
N$7
  Top 0.152: R3.2 24.4,25.91 Q1.B
N$8
  Top 0.152: R4.2 28.07,22.86 29.02,23.81 Q2.B
N$9
  Top 0.152: R8.2 80.2,23.7 80.16,23.7 79.55,23.09 76.66,23.09 76.05,23.7 75.44,23.7 LED0.4 75.36,23.7
N$10
  Top 0.152: 77.11,23.77 LED0.3 77.19,23.77 79.02,23.77 80.47,25.22 R9.2 80.5,25.27
N$11
  Top 0.152: 80.68,26.39 80.63,26.41 R10.2 80.62,26.52 78.72,24.61 77.11,24.61 LED0.2
N$12  (via drill 0.35)
  Top 0.152: v41.45,19.74 42.9,18.29 42.9,17.22 U4.22 | v38.86,22.33 38.25,22.94 37.64,22.94 35.51,20.8 v35.51,18.14 | R22.1 34.9,12.04 34.9,11.12 32.08,8.31 30.48,8.31 J2.R8
  Bottom 0.152: v38.86,22.33 v41.45,19.74 | v35.51,18.14 35.51,13.56 30.48,8.53 30.48,8.31 J2.R8
N$13  (via drill 0.35)
  Top 0.152: v40.54,19.74 42.37,17.91 42.37,17.22 U4.23 | v36.12,20.5 v37.95,22.33 | R21.1 32.08,13.34 30.71,11.96 30.02,11.96 27.96,9.91 27.96,9.6 J2.R7
  Bottom 0.152: v37.95,22.33 v40.54,19.74 | v36.12,20.5 36.12,19.89 30.71,14.48 30.02,14.48 29.11,13.56 29.11,10.74 27.96,9.6 J2.R7
N$14
  Top 0.152: LED1.4 75.36,18.59 76.05,18.59 76.81,17.83 80.62,17.83 R11.2
N$15
  Top 0.152: LED1.3 77.11,18.67 80.24,18.67 R12.2
N$16
  Top 0.152: LED1.2 77.11,19.51 79.86,19.51 80.62,20.27 R13.2
N$17
  Top 0.152: U4.20 43.89,17.22 43.89,19.05 43.66,19.28 43.66,20.34 40.46,23.55 37.11,23.55 31.85,18.29 27.51,18.29 26.82,17.6 26.82,16.69 27.58,15.93 30.4,15.93 J2.R2 30.48,15.93 34.9,15.93 R20.1
N$18
  Top 0.152: 44.62,10.71 45.72,9.6 R33.1 | 44.62,10.71 43.97,11.35 43.97,13.26 U4.11 | 44.62,10.71 45.47,11.56 R24.1
N$19
  Top 0.152: R23.1 34.9,20.65 37.49,23.24 40.31,23.24 43.36,20.19 43.36,17.22 U4.21 | R23.1 27.96,17.14 J2.R1 | R23.1
N$20  (via drill 0.35)
  Top 0.152: R34.1 41.4,11.91 v41.83,12.34 41.91,12.34 41.91,13.26 U4.7 | R25.1 49.84,11.81 v49.68,11.66
  Bottom 0.152: v49.68,11.66 48.23,11.66 46.41,9.83 44.35,9.83 v41.83,12.34
N$21  (via drill 0.35)
  Top 0.152: U4.8 42.44,13.26 42.44,10.29 42.67,10.01 R35.1 42.49,8.91 v40.28,8.91 | v49.07,9.6 49.07,9.65 R26.1 | v44.04,7.24 v46.94,7.24
  Bottom 0.152: v49.07,9.6 49.07,9.37 v46.94,7.24 | v44.04,7.24 41.58,7.24 40.28,8.53 v40.28,8.91
N$22
  Top 0.152: U4.24 41.91,17.22 39.4,19.74 R28.2
N$23  (via drill 0.35)
  Top 0.152: v38.33,15.47 41.22,15.47 U4.3 | v32.31,9.45 29.49,9.45 28.25,8.21 26.81,8.59 26.67,12.96 25.65,13.97 19.05,13.97 17.07,16 17.07,17.37 18.03,18.16 18.03,22.23 | R31.1 18.03,22.23 | 18.03,22.23 R30.1
  Bottom 0.152: v32.31,9.45 v38.33,15.47
N$24
  Top 0.152: U4.2 41.22,16 40.87,16 40.54,16.33 40.13,16.64 38.58,16.64 37.34,15.65 37.34,11.99 36.27,10.92 36.27,6.4 R29.1
N$25
  Top 0.152: R29.2 34.9,6.4 26.06,6.4 22.71,9.75 17.53,9.75 16.76,8.99 J2.L2
N$26
  Top 0.152: 15.28,22.23 R30.2 15.37,21.84 15.37,20.32 J2.L4
N$27
  Top 0.152: R37.2 90.45,26.06 93.34,28.96 93.34,29.57 U3.8
N$28
  Top 0.152: U4.15 45.19,15.01 52.81,15.01 53.34,14.48 53.95,14.48 54.94,15.47 54.94,16.08 53.59,17.42 51.79,17.42 48.26,20.95 R36.1 C11.1
N$29
  Top 0.152: U4.10 43.43,13.26 43.43,11.23 44.45,10.21 R32.1
PHY_VDDCR
  Top 0.152: U4.6 41.22,13.95 41.22,12.65 38.79,10.21 C12.1 38.79,10.13 38.79,8.91 C13.1
U0_DTR  (via drill 0.35)
  Top 0.152: Q2.E 30.52,23.05 30.52,25.91 R3.1 27.32,27.52 27.3,27.53 v27.3,27.66 | v20.42,27.64 17.44,27.64 15.81,29.46 U6.28
  Bottom 0.152: v27.3,27.66 27.28,27.64 v20.42,27.64
U0_RTS  (via drill 0.35)
  Top 0.152: U6.24 15.23,27.43 15.35,27.38 v15.88,26.86 | v19.75,26.86 20.13,26.48 Q1.E 21.91,22.86 R4.1
  Bottom 0.152: v19.75,26.86 v15.88,26.86
U0_RXD0  (via drill 0.35)
  Top 0.152: U6.26 16.11,28.45 17.78,26.67 17.78,24.83 16.51,23.5 14.22,23.5 13.34,22.61 13.34,7.62 16.51,4.45 19.68,4.45 21.27,2.86 77.47,2.86 v78.42,3.81 | U1.34 104.33,4 v103.25,5.08
  Bottom 0.152: v103.25,5.08 102.99,5.08 100.01,1.91 80.33,1.91 v78.42,3.81
U0_TXD0  (via drill 0.35)
  Top 0.152: U6.25 15.94,27.94 16.84,26.99 17.14,26.67 17.14,24.83 16.51,24.13 13.97,24.13 12.7,22.86 12.7,7.35 16.19,3.81 19.23,3.81 20.79,2.25 76.2,2.22 v78.11,2.22 | U1.35 105.6,4.06 v104.58,5.08
  Bottom 0.152: v104.58,5.08 103.12,3.62 100.9,1.33 100.83,1.27 79.06,1.27 v78.11,2.22
USB_DN
  Top 0.152: J1.3 6.45,30.48 7.06,31.09 10.16,31.09 10.16,31.08 11.28,31.08 11.48,30.88 11.48,30.39 U6.5
USB_DP
  Top 0.152: J1.2 4.65,31.17 6.6,31.17 6.83,31.39 10.79,31.39 10.8,31.39 11.4,31.39 11.93,30.86 11.93,30.44 U6.4
V_USB  (via drill 0.35)
  Top 0.305: U6.8 8.59,29.45 v7.62,29.21
  Top 0.406: J1.1 5.39,31.78
  Top 0.508: 5.39,31.78 v7.62,33.02
  Top 0.61: v7.62,33.02 D1.2
  Bottom 0.61: v7.62,33.02 v7.62,29.21
(copper drawn outside any net)
  shapes: Bottom area x1